# Altium schematic sheet Battery Reader.SchDoc: Battery Reader
size A3; Author: Borja Serra; CompanyName: Blueye Robotics; Organization: Blueye Robotics AS; Address1: Transittgata 10; Address2: 7042 Trondheim; Address3: Norway; Revision: 0; SheetNumber: 2; SheetTotal: 3
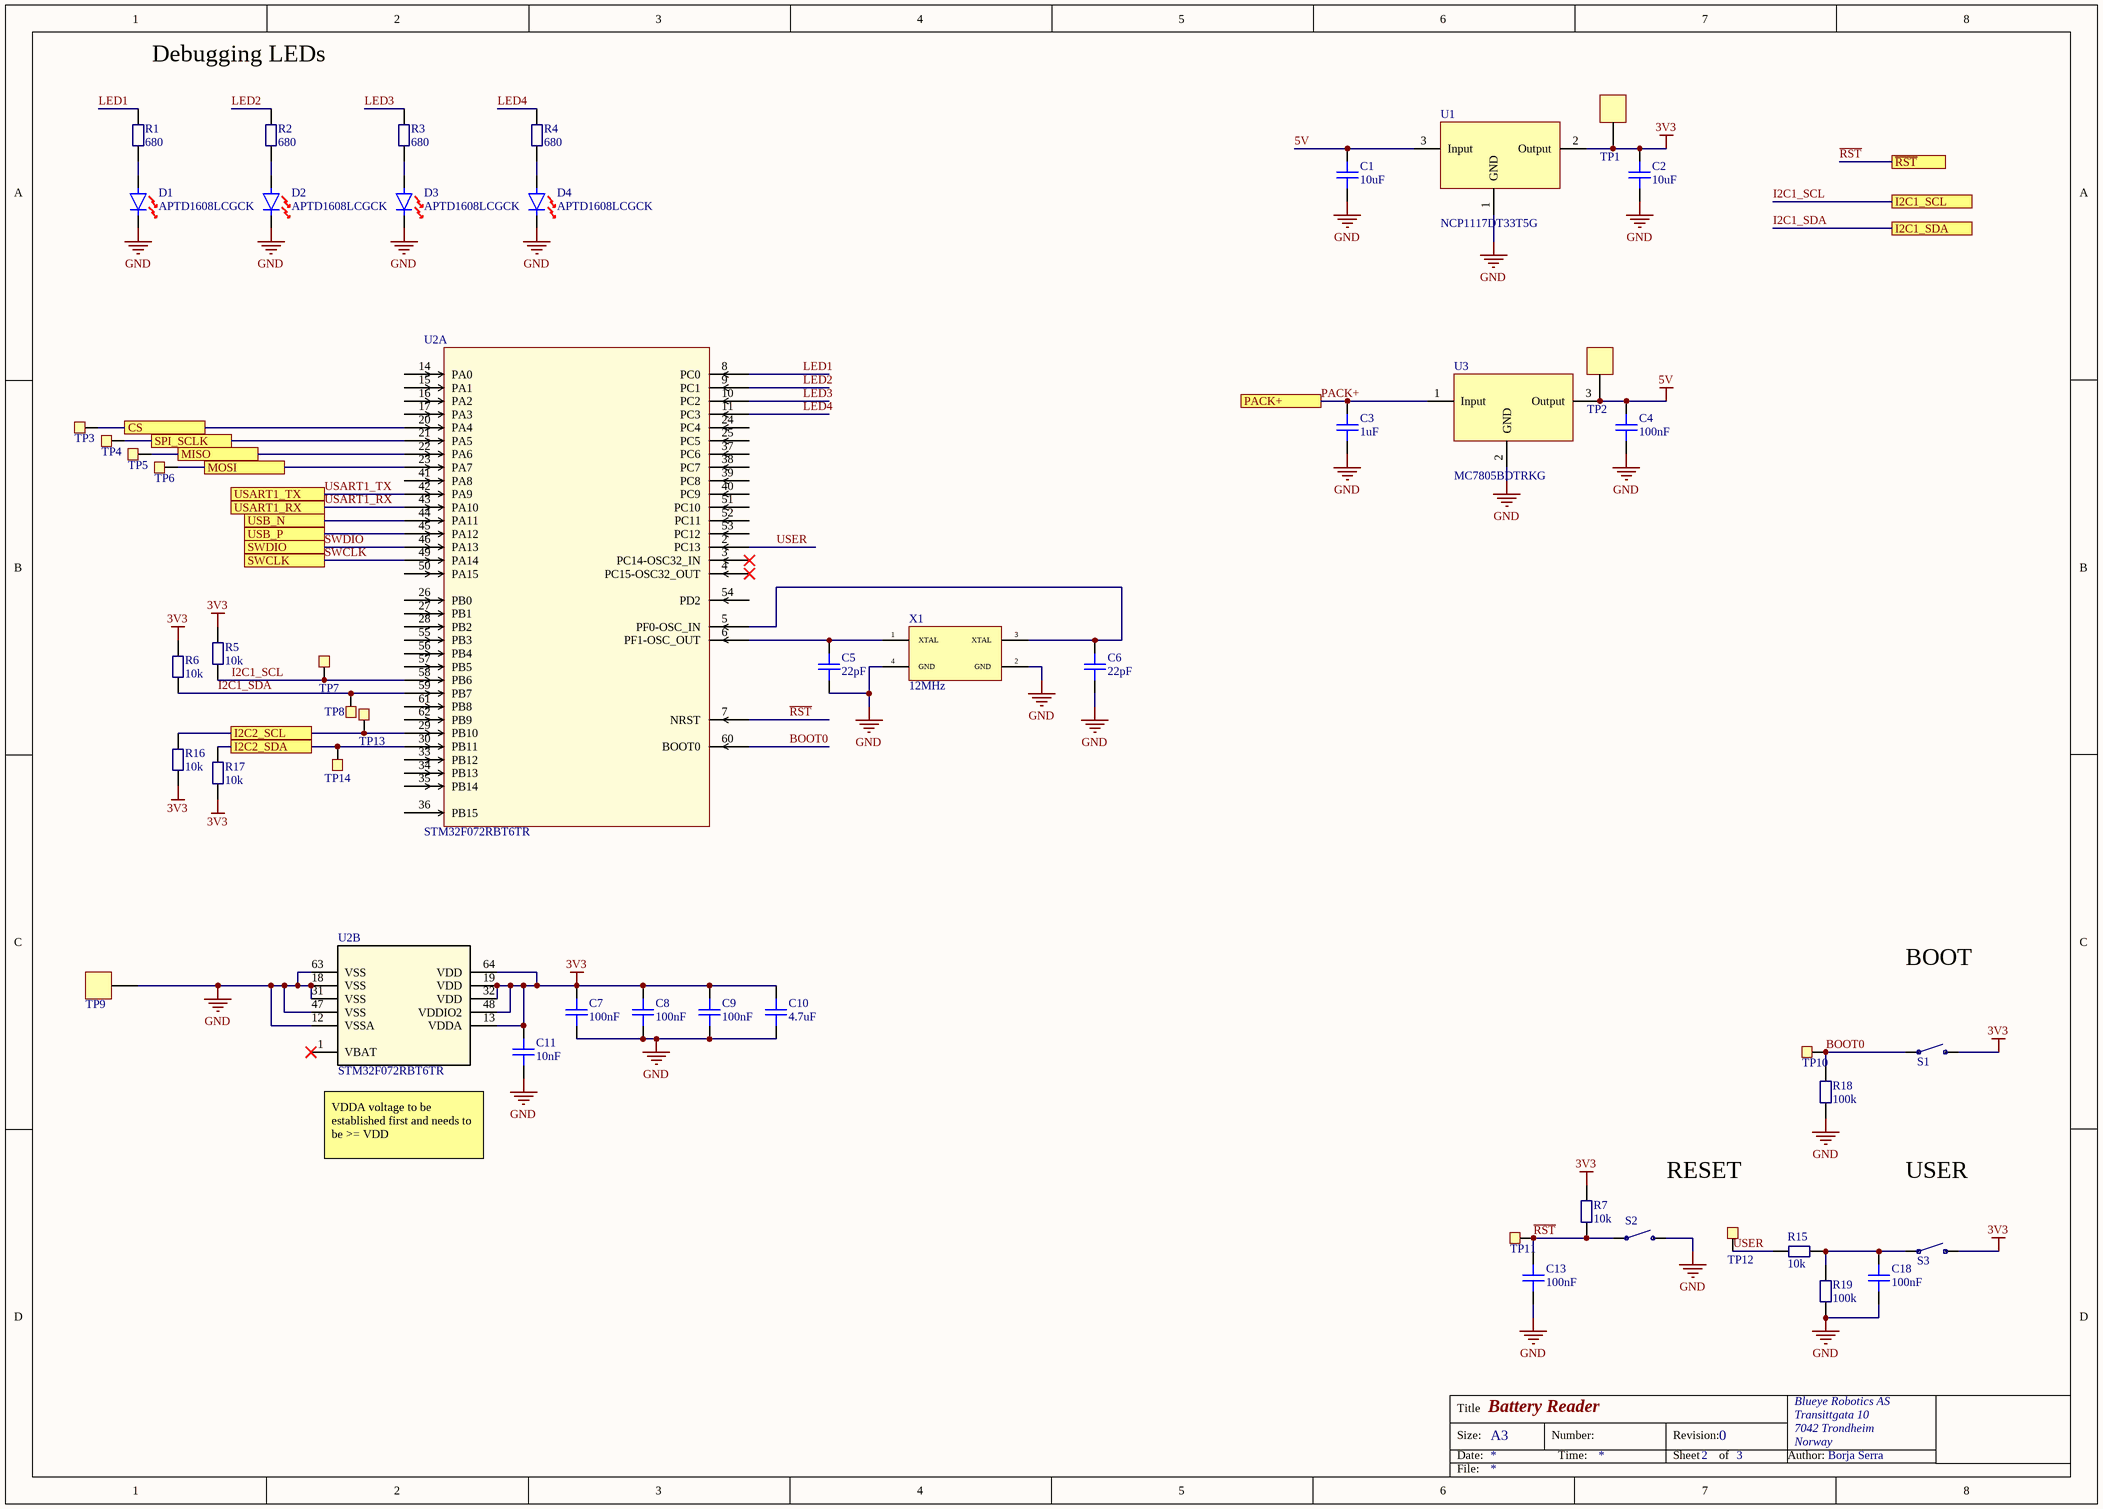
[diagram p0: Battery Reader.SchDoc]

## Parts
C1  10uF  [1206 CAPACITOR]
C2  10uF  [1206 CAPACITOR]
C3  1uF  [1206 CAPACITOR]
C4  100nF  [0603 Capacitor]
C5  22pF  [0603 Capacitor]
C6  22pF  [0603 Capacitor]
C7  100nF  [0603 Capacitor]
C8  100nF  [0603 Capacitor]
C9  100nF  [0603 Capacitor]
C10  4.7uF  [0805 Capacitor]
C11  10nF  [0603 Capacitor]
C13  100nF  [0603 Capacitor]
C18  100nF  [0603 Capacitor]
D1  APTD1608LCGCK  [0603 LED]
D2  APTD1608LCGCK  [0603 LED]
D3  APTD1608LCGCK  [0603 LED]
D4  APTD1608LCGCK  [0603 LED]
R1  680  [0603 Resistor]
R2  680  [0603 Resistor]
R3  680  [0603 Resistor]
R4  680  [0603 Resistor]
R5  10k  [0603 Resistor]
R6  10k  [0603 Resistor]
R7  10k  [0603 Resistor]
R15  10k  [0603 Resistor]
R16  10k  [0603 Resistor]
R17  10k  [0603 Resistor]
R18  100k  [0603 Resistor]
R19  100k  [0603 Resistor]
S1  Tactile Switches Reset  [Tact Switch - panasonic]  (value not drawn)
S2  Tactile Switches Reset  [Tact Switch - panasonic]  (value not drawn)
S3  Tactile Switches Reset  [Tact Switch - panasonic]  (value not drawn)
TP1  3122-2-00-15-00-00-08-0  [3122-2-00-15-00-00-08-0]  (value not drawn)
TP2  3122-2-00-15-00-00-08-0  [3122-2-00-15-00-00-08-0]  (value not drawn)
TP3  Testpoint  [Testpoint]  (value not drawn)  (no BOM)
TP4  Testpoint  [Testpoint]  (value not drawn)  (no BOM)
TP5  Testpoint  [Testpoint]  (value not drawn)  (no BOM)
TP6  Testpoint  [Testpoint]  (value not drawn)  (no BOM)
TP7  Testpoint  [Testpoint]  (value not drawn)  (no BOM)
TP8  Testpoint  [Testpoint]  (value not drawn)  (no BOM)
TP9  3122-2-00-15-00-00-08-0  [3122-2-00-15-00-00-08-0]  (value not drawn)
TP10  Testpoint  [Testpoint]  (value not drawn)  (no BOM)
TP11  Testpoint  [Testpoint]  (value not drawn)  (no BOM)
TP12  Testpoint  [Testpoint]  (value not drawn)  (no BOM)
TP13  Testpoint  [Testpoint]  (value not drawn)  (no BOM)
TP14  Testpoint  [Testpoint]  (value not drawn)  (no BOM)
U1  NCP1117DT33T5G  [DPAK-3]
U2  STM32F072RBT6TR  [LQFP64-10x10mm]  (parts A,B of 2)
U3  MC7805BDTRKG  [DPAK-3]
X1  12MHz  [FH1200001 12MHz]

## Ports
CS, I2C1_SCL, I2C1_SDA, I2C2_SCL, I2C2_SDA, MISO, MOSI, PACK+, SPI_SCLK, SWCLK, SWDIO, USART1_RX, USART1_TX, USB_N, USB_P, ~{RST}

## Nets
3V3: C2.2 C7.2 C8.2 C9.2 C10.2 C11.2 R5.2 R6.2 R7.2 R16.1 R17.1 S1.2 S3.2 TP1.1 U1.2(Output) U2.13(VDDA) U2.19(VDD) U2.32(VDD) U2.48(VDDIO2) U2.64(VDD)
5V: C1.2 C4.2 TP2.1 U1.3(Input) U3.3(Output)
GND: C1.1 C2.1 C3.1 C4.1 C5.1 C6.1 C7.1 C8.1 C9.1 C10.1 C11.1 C13.1 C18.1 D1.1 D2.1 D3.1 D4.1 R18.1 R19.1 S2.2 TP9.1 U1.1(GND) U2.12(VSSA) U2.18(VSS) U2.31(VSS) U2.47(VSS) U2.63(VSS) U3.2(GND) X1.2(GND) X1.4(GND)
BOOT0: R18.2 S1.1 TP10.1 U2.60(BOOT0)
CS: TP3.1 U2.20(PA4) ; port CS
I2C1_SCL: R5.1 TP7.1 U2.58(PB6) ; port I2C1_SCL
I2C1_SDA: R6.1 TP8.1 U2.59(PB7) ; port I2C1_SDA
I2C2_SCL: R16.2 TP13.1 U2.29(PB10) ; port I2C2_SCL
I2C2_SDA: R17.2 TP14.1 U2.30(PB11) ; port I2C2_SDA
LED1: R1.2 U2.8(PC0)
LED2: R2.2 U2.9(PC1)
LED3: R3.2 U2.10(PC2)
LED4: R4.2 U2.11(PC3)
MISO: TP5.1 U2.22(PA6) ; port MISO
MOSI: TP6.1 U2.23(PA7) ; port MOSI
PACK+: C3.2 U3.1(Input) ; port PACK+
~{RST}: C13.2 R7.1 S2.1 TP11.1 U2.7(NRST) ; port ~{RST}
SPI_SCLK: TP4.1 U2.21(PA5) ; port SPI_SCLK
SWCLK: U2.49(PA14) ; port SWCLK
SWDIO: U2.46(PA13) ; port SWDIO
USART1_RX: U2.43(PA10) ; port USART1_RX
USART1_TX: U2.42(PA9) ; port USART1_TX
USB_N: U2.44(PA11) ; port USB_N
USB_P: U2.45(PA12) ; port USB_P
USER: R15.1 TP12.1 U2.2(PC13)
NetC5_2: C5.2 U2.6(PF1-OSC_OUT) X1.1(XTAL)
NetC6_2: C6.2 U2.5(PF0-OSC_IN) X1.3(XTAL)
NetC18_2: C18.2 R15.2 R19.2 S3.1
NetD1_2: D1.2 R1.1
NetD2_2: D2.2 R2.1
NetD3_2: D3.2 R3.1
NetD4_2: D4.2 R4.1

Not connected (* = marked no-connect by the designer): U2 1(VBAT)* 3(PC14-OSC32_IN)* 4(PC15-OSC32_OUT)* 14(PA0) 15(PA1) 16(PA2) 17(PA3) 24(PC4) 25(PC5) 26(PB0) 27(PB1) 28(PB2) 33(PB12) 34(PB13) 35(PB14) 36(PB15) 37(PC6) 38(PC7) 39(PC8) 40(PC9) 41(PA8) 50(PA15) 51(PC10) 52(PC11) 53(PC12) 54(PD2) 55(PB3) 56(PB4) 57(PB5) 61(PB8) 62(PB9)

## Notes on the sheet
- Debugging LEDs
- BOOT
- VDDA voltage to be established first and needs to be >= VDD
- RESET
- USER
- Title
- Size:
- Date:
- A3
- Number:
- Time:
- Revision:
- Sheet
- of
- Author:
- File:

## Library data of the parts
C1 C2 = CAP CER 10UF 35V X7R 1206: MPN: GMK316AB7106KL-TR; Manufacturer: Taiyo Yuden; value: 10uF; Supplier 1: Digi-Key; Supplier Part Number 1: 587-3007-1-ND
C3 = Capacitor 1uF 50V: Multilayer Ceramic Capacitors MLCC - SMD/SMT 1206 1.0uF 50V X7R 20%; Manufacturer: TDK; MPN: C3216X7R1H105M160AB; SPN: 810-C3216X7R1H105M; Supplier: Mouser
C4 C7-C9 C13 C18 = CAP CER 0.1UF 50V X7R 0603: MPN: CL10B104KB8NNNC; Manufacturer: Samsung Electro-Mechanics; value: 100nF; Supplier 1: Digi-Key; Supplier Part Number 1: 1276-1000-1-ND
C5 C6 = CAP CER 22PF 50V X7R 0603: MPN: 06035C220JAT2A; Manufacturer: AVX Corporation; value: 22pF; Supplier 1: Digi-Key; Supplier Part Number 1: 478-6204-1-ND
C10 = Capacitor 4.7uF 25V: Multilayer Ceramic Capacitors MLCC - SMD/SMT 4.7uF 25Volts 10%; Manufacturer: Murata Electronics; MPN: GRM21BR61E475KA12K; SPN: 81-GRM21BR61E475KA2K; Supplier: Mouser
C11 = Capacitor 10nF: Multilayer CeramicCapacitors MLCC - SMD/SMT 100volts .01uF 10% X7R AUTO ESD; MPN: C0603C103K1RECAUTO; Manufacturer: Kemet; SPN: 80-C0603C103K1REAUTO; Supplier: Mouser
D1-D4 = Standard LEDs - SMD 0603 Dome Lens LED Green- 570nm: Manufacturer: Kingbright; SPN: 604-APTD1608LCGCK; Supplier: Digi-Key; MPN: APTD1608LCGCK
R1-R4 = resistor 680 ohm: Thick Film Resistors - SMD 0603 680ohms 5% AEC-Q200; MPN: ERJ-3GEYJ681V; Manufacturer: Panasonic; SPN: 667-ERJ-3GEYJ681V; Supplier: Mouser
R5-R7 R15-R17 = RES SMD 10K OHM 5% 1/10W 0603: Manufacturer: Yageo; MPN: RC0603JR-0710KL; Supplier Part Number 1: 311-10KGRCT-ND; Supplier 1: Digi-Key; Value: 10k
R18 R19 = RES SMD 100K OHM 5% 1/10W 0603: MPN: RC0603JR-07100KL; Manufacturer: Yageo; Value: 100k; Supplier 1: Digi-Key; Supplier Part Number 1: 311-100KGRCT-ND
S1-S3 = Tactile Switches Reset: Tactile Switches 6.0x3.5mm SMD Light Touch Switch; Manufacturer: Panasonic; MPN: EVQ-PE105K; SPN: 667-EVQ-PE105K; Supplier: Mouser
TP1 TP2 TP9 = 3122-2-00-15-00-00-08-0: CONN PC PIN CIRC 0.040DIA GOLD; Manufacturer: Mill-Max; Manufacturer Part Number: 3123-2-00-15-00-00-08-0; SPN: ED1277-ND; Plating: Nickel,Gold; Gender: Male; Insulation: Non-Insulated; Outside Diameter: 1.78mm; Flange Diameter: 0.07inch; Mounting Hole Diameter: 1.09mm; Board Thickness: 0.062inch; Hole Diameter: 0.043inch; MPN: 3122-2-00-15-00-00-08-0; Supplier: Digi-Key; Supplier 1: Digi-Key; Stock 1: 3576; Pricing 1: 1=0.34, 10=0.323, 25=0.2768, 50=0.2354, 100=0.2261, 250=0.2031, 500=0.1938, 1000=0.1615, 2500=0.1477 (USD); Mount: Through Hole; Contact Material: Brass; Material: Brass; Contact Plating: Gold; Package Quantity: 500; Packaging: Bulk; Termination: PC Pin; Length: 0.682inch; ComponentLink1URL: http://www.mouser.com/ds/2/273/221M-269451.pdf; ComponentLink1Description: http://www.mouser.com/ds/2/273/221M-269451.pdf; ComponentLink2URL: http://www.mill-max.com/assets/pdfs/metric/221M.pdf; ComponentLink2Description: http://www.mill-max.com/assets/pdfs/metric/221M.pdf; Supplier Part Number 1: ED1182-ND
U1 = IC REG LINEAR 3.3V 1A DPAK-3: Manufacturer: ON Semiconductor; SPN: NCP1117DT33T5GOSCT-ND; Supplier: Digi-Key; MPN: NCP1117DT33T5G
U2 = STM32F072RBT6TR: Vendor: STMicroelectronics; C: Copyright (C) 2016 Accelerated Designs. All rights reserved; SPN: 497-17363-1-ND; Copyright: Copyright (C) 2016 Accelerated Designs. All rights reserved; Manufacturer_Part_Number: STM32F072RBT6TR; RefDes: RefDes; Type: Type; Value: Value; Supplier: Digi-Key; MPN: STM32F072RBT6TR
U3 = IC REG LINEAR 5V 1A DPAK-3: Manufacturer: ON Semiconductor; SPN: MC7805BDTRKGOSCT-ND; Supplier: Digi-Key; MPN: MC7805BDTRKG
X1 = Crystal 12MHz: Manufacturer: Pericom; MPN: FH1200001; SPN: 729-FH1200001; Supplier: Mouser